# Altium schematic sheet imxbbdimm.SchDoc: IMXBB
size A3; DocumentNumber: 1; Revision: 2.0; SheetNumber: 1; SheetTotal: 9
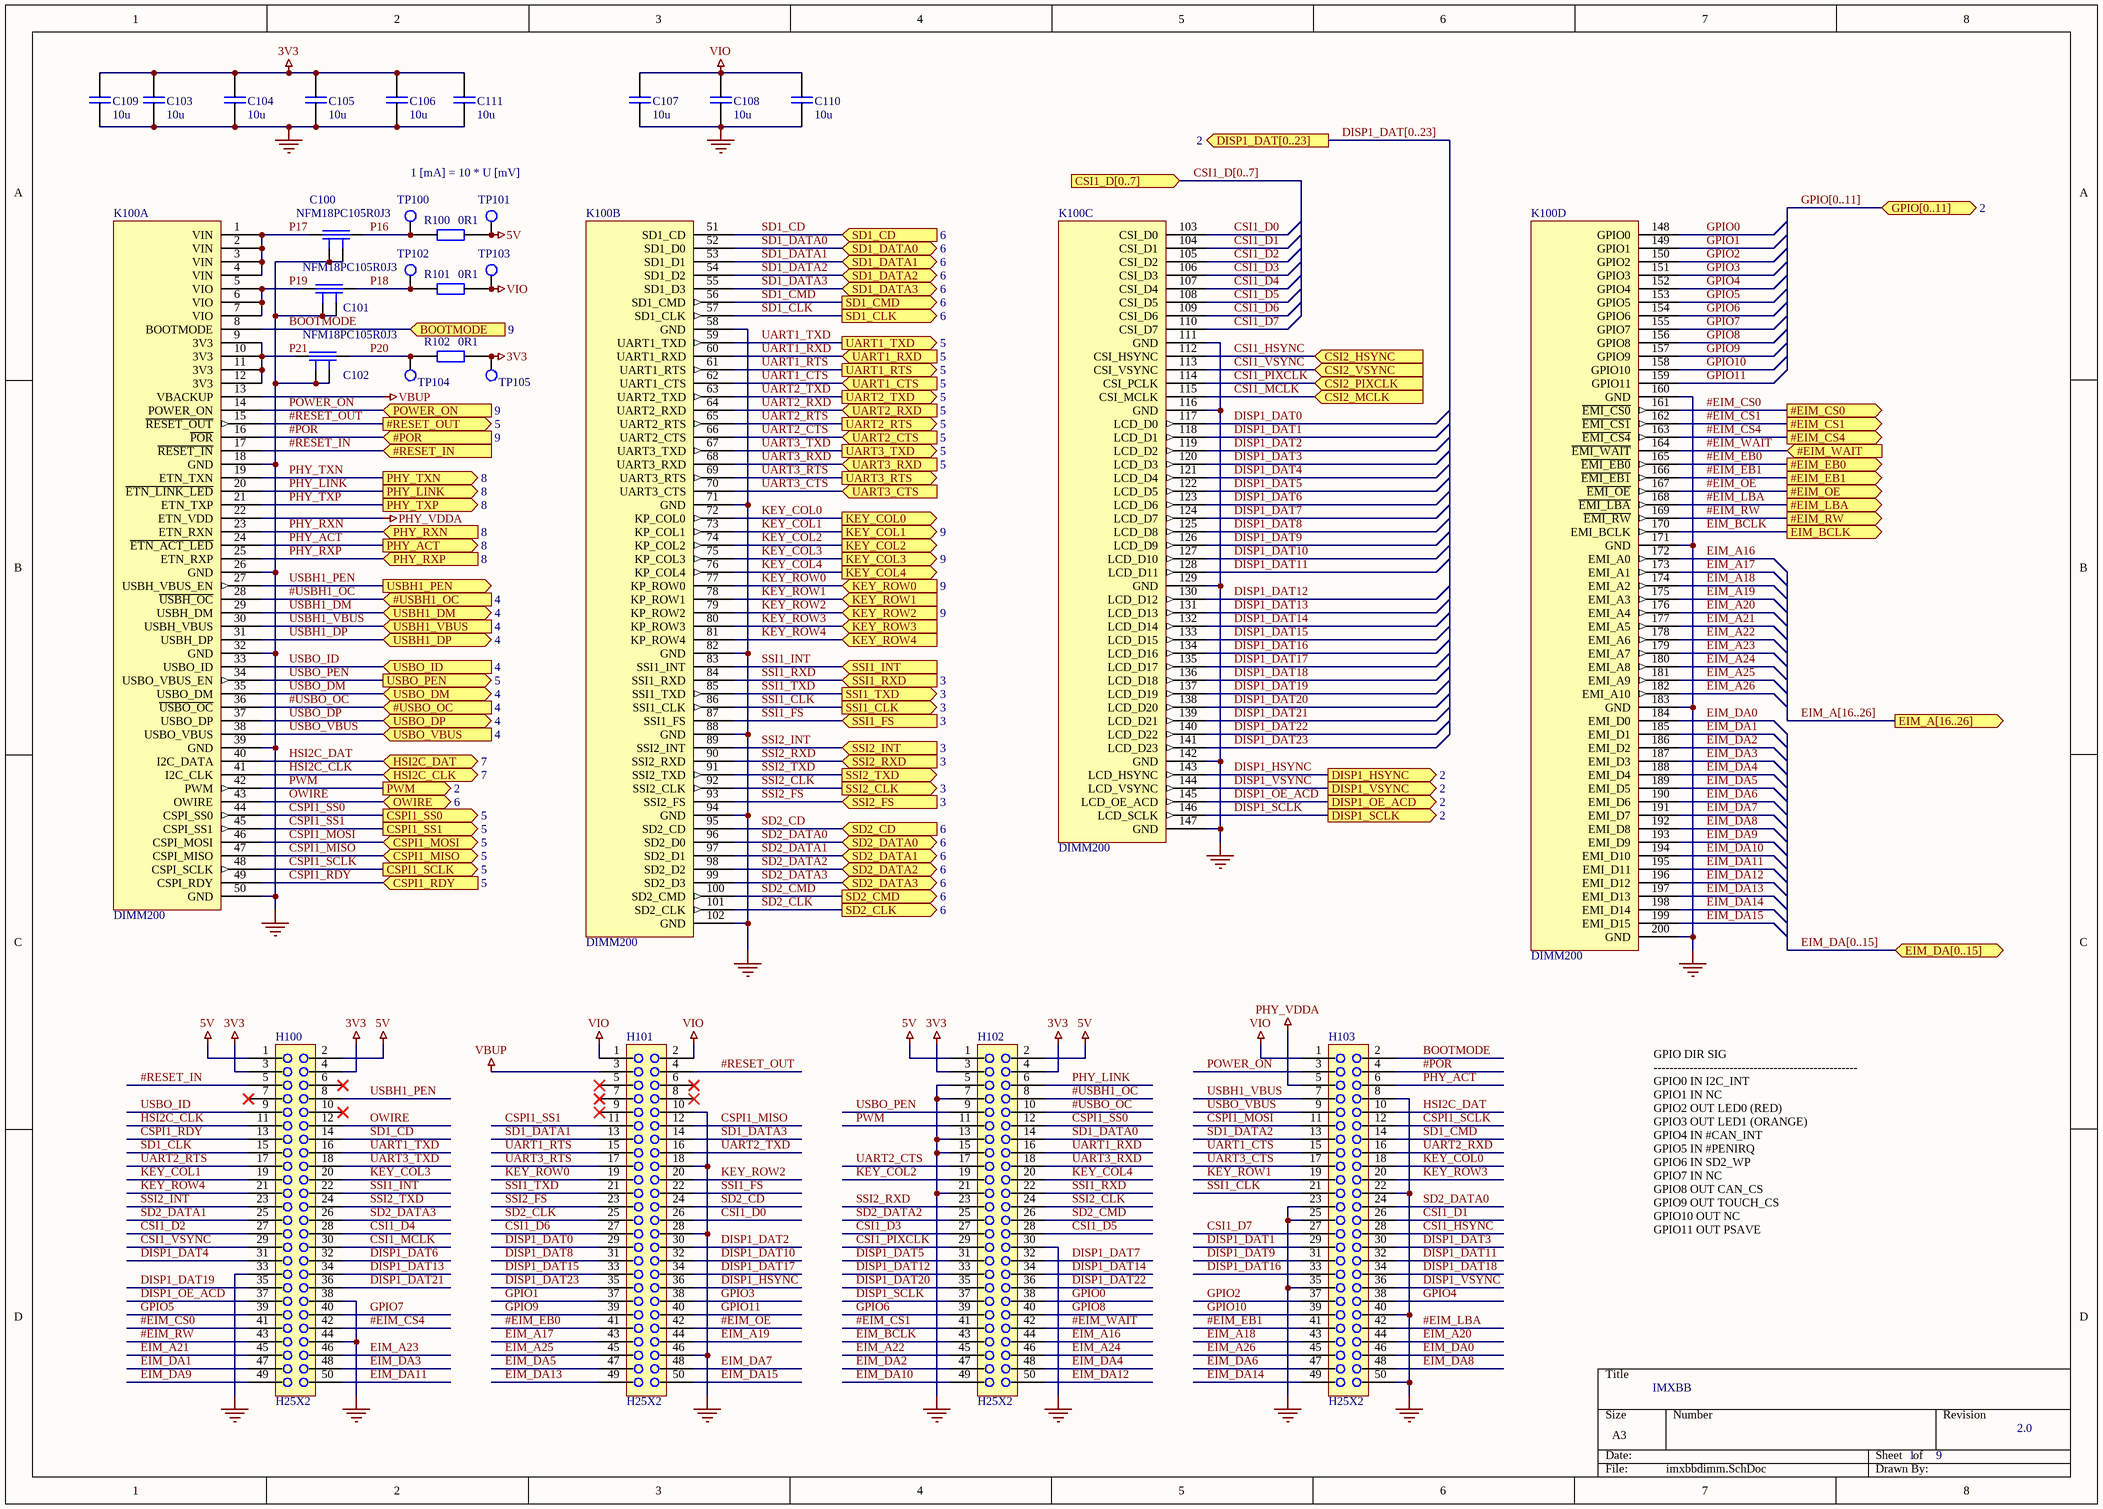
[diagram p0: imxbbdimm.SchDoc]

## Parts
C100  NFM18PC105R0J3  [NFM18P]
C101  NFM18PC105R0J3  [NFM18P]
C102  NFM18PC105R0J3  [NFM18P]
C103  10u  [0805]
C104  10u  [0805]
C105  10u  [0805]
C106  10u  [0805]
C107  10u  [0805]
C108  10u  [0805]
C109  10u  [0805]
C110  10u  [0805]
C111  10u  [0805]
H100  H25X2  [H2x25]
H101  H25X2  [H2x25]
H102  H25X2  [H2x25]
H103  H25X2  [H2x25]
K100  DIMM200  [SODIMM200EDGE]  (parts A,B,C,D of 4)
R100  0R1  [0603]
R101  0R1  [0603]
R102  0R1  [0603]
TP100  TESTPOINT  [TESTPOINT_2mm]  (value not drawn)
TP101  TESTPOINT  [TESTPOINT_2mm]  (value not drawn)
TP102  TESTPOINT  [TESTPOINT_2mm]  (value not drawn)
TP103  TESTPOINT  [TESTPOINT_2mm]  (value not drawn)
TP104  TESTPOINT  [TESTPOINT_2mm]  (value not drawn)
TP105  TESTPOINT  [TESTPOINT_2mm]  (value not drawn)

## Ports
#EIM_CS0 (out), #EIM_CS1 (out), #EIM_CS4 (out), #EIM_EB0 (out), #EIM_EB1 (out), #EIM_LBA (out), #EIM_OE (out), #EIM_RW (out), #EIM_WAIT (in), #POR (in, see 9), #RESET_IN (in), #RESET_OUT (out, see 5), #USBH1_OC (in, see 4), #USBO_OC (in, see 4), BOOTMODE (in, see 9), CSI1_D[0..7] (in), CSI2_HSYNC (in), CSI2_MCLK (in), CSI2_PIXCLK (in), CSI2_VSYNC (in), CSPI1_MISO (bidir, see 5), CSPI1_MOSI (bidir, see 5), CSPI1_RDY (in, see 5), CSPI1_SCLK (out, see 5), CSPI1_SS0 (out, see 5), CSPI1_SS1 (out, see 5), DISP1_DAT[0..23] (out, see 2), DISP1_HSYNC (out, see 2), DISP1_OE_ACD (out, see 2), DISP1_SCLK (out, see 2), DISP1_VSYNC (out, see 2), EIM_A[16..26] (out), EIM_BCLK (out), EIM_DA[0..15] (bidir), GPIO[0..11] (bidir, see 2), HSI2C_CLK (bidir, see 7), HSI2C_DAT (bidir, see 7), KEY_COL0 (out), KEY_COL1 (out, see 9), KEY_COL2 (out), KEY_COL3 (out, see 9), KEY_COL4 (out), KEY_ROW0 (in, see 9), KEY_ROW1 (in), KEY_ROW2 (in, see 9), KEY_ROW3 (in), KEY_ROW4 (in), OWIRE (bidir, see 6), PHY_ACT (out, see 8), PHY_LINK (out, see 8), PHY_RXN (in, see 8), PHY_RXP (in, see 8), PHY_TXN (out, see 8), PHY_TXP (out, see 8), POWER_ON (in, see 9), PWM (out, see 2), SD1_CD (in, see 6), SD1_CLK (out, see 6), SD1_CMD (out, see 6), SD1_DATA0 (bidir, see 6), SD1_DATA1 (bidir, see 6), SD1_DATA2 (bidir, see 6), SD1_DATA3 (bidir, see 6), SD2_CD (in, see 6), SD2_CLK (out, see 6), SD2_CMD (out, see 6), SD2_DATA0 (bidir, see 6), SD2_DATA1 (bidir, see 6), SD2_DATA2 (bidir, see 6), SD2_DATA3 (bidir, see 6), SSI1_CLK (out, see 3), SSI1_FS (in, see 3), SSI1_INT (in), SSI1_RXD (in, see 3), SSI1_TXD (out, see 3), SSI2_CLK (out, see 3), SSI2_FS (in, see 3), SSI2_INT (in, see 3), SSI2_RXD (in, see 3), SSI2_TXD (out), UART1_CTS (in, see 5), UART1_RTS (out, see 5), UART1_RXD (in, see 5), UART1_TXD (out, see 5), UART2_CTS (in, see 5), UART2_RTS (out, see 5), UART2_RXD (in, see 5), UART2_TXD (out, see 5), UART3_CTS (in), UART3_RTS (out), UART3_RXD (in, see 5), UART3_TXD (out, see 5), USBH1_DM (bidir, see 4), USBH1_DP (bidir, see 4), USBH1_PEN (out), USBH1_VBUS (in, see 4), USBO_DM (bidir, see 4), USBO_DP (bidir, see 4), USBO_ID (in, see 4), USBO_PEN (out, see 5), USBO_VBUS (in, see 4)

## Nets
3V3: C103.2 C104.2 C105.2 C106.2 C109.2 C111.2 H100.3 H100.4 H102.3 H102.4 R102.2 TP105.1
5V: H100.1 H100.2 H102.1 H102.2 R100.2 TP101.1
GND: C100.2 C100.4 C101.2 C101.4 C102.2 C102.4 C103.1 C104.1 C105.1 C106.1 C107.1 C108.1 C109.1 C110.1 C111.1 H100.33 H100.38 H100.44 H101.10 H101.18 H101.28 H101.46 H102.5 H102.7 H102.13 H102.15 H102.21 H102.30 H103.8 H103.22 H103.23 H103.25 H103.35 H103.40 H103.50 K100.18(GND) K100.26(GND) K100.32(GND) K100.39(GND) K100.50(GND) K100.58(GND) K100.71(GND) K100.82(GND) K100.88(GND) K100.94(GND) K100.102(GND) K100.111(GND) K100.116(GND) K100.129(GND) K100.142(GND) K100.147(GND) K100.160(GND) K100.171(GND) K100.183(GND) K100.200(GND)
PHY_VDDA: H103.5 K100.22(ETN_VDD)
VBUP: H101.3 K100.13(VBACKUP)
VIO: C107.2 C108.2 C110.2 H101.1 H101.2 H103.1 R101.2 TP103.1
#EIM_CS0: H100.41 K100.161(~{EMI_CS0}) ; port #EIM_CS0
#EIM_CS1: H102.41 K100.162(~{EMI_CS1}) ; port #EIM_CS1
#EIM_CS4: H100.42 K100.163(~{EMI_CS4}) ; port #EIM_CS4
#EIM_EB0: H101.41 K100.165(~{EMI_EB0}) ; port #EIM_EB0
#EIM_EB1: H103.41 K100.166(~{EMI_EB1}) ; port #EIM_EB1
#EIM_LBA: H103.42 K100.168(~{EMI_LBA}) ; port #EIM_LBA
#EIM_OE: H101.42 K100.167(~{EMI_OE}) ; port #EIM_OE
#EIM_RW: H100.43 K100.169(~{EMI_RW}) ; port #EIM_RW
#EIM_WAIT: H102.42 K100.164(~{EMI_WAIT}) ; port #EIM_WAIT
#POR: H103.4 K100.16(~{POR}) ; port #POR
#RESET_IN: H100.5 K100.17(~{RESET_IN}) ; port #RESET_IN
#RESET_OUT: H101.4 K100.15(~{RESET_OUT}) ; port #RESET_OUT
#USBH1_OC: H102.8 K100.28(~{USBH_OC}) ; port #USBH1_OC
#USBO_OC: H102.10 K100.36(~{USBO_OC}) ; port #USBO_OC
BOOTMODE: H103.2 K100.8(BOOTMODE) ; port BOOTMODE
CSI1_D0: H101.26 K100.103(CSI_D0)
CSI1_D1: H103.26 K100.104(CSI_D1)
CSI1_D2: H100.27 K100.105(CSI_D2)
CSI1_D3: H102.27 K100.106(CSI_D3)
CSI1_D4: H100.28 K100.107(CSI_D4)
CSI1_D5: H102.28 K100.108(CSI_D5)
CSI1_D6: H101.27 K100.109(CSI_D6)
CSI1_D7: H103.27 K100.110(CSI_D7)
CSI1_HSYNC: H103.28 K100.112(CSI_HSYNC) ; port CSI2_HSYNC
CSI1_MCLK: H100.30 K100.115(CSI_MCLK) ; port CSI2_MCLK
CSI1_PIXCLK: H102.29 K100.114(CSI_PCLK) ; port CSI2_PIXCLK
CSI1_VSYNC: H100.29 K100.113(CSI_VSYNC) ; port CSI2_VSYNC
CSPI1_MISO: H101.12 K100.47(CSPI_MISO) ; port CSPI1_MISO
CSPI1_MOSI: H103.11 K100.46(CSPI_MOSI) ; port CSPI1_MOSI
CSPI1_RDY: H100.13 K100.49(CSPI_RDY) ; port CSPI1_RDY
CSPI1_SCLK: H103.12 K100.48(CSPI_SCLK) ; port CSPI1_SCLK
CSPI1_SS0: H102.12 K100.44(CSPI_SS0) ; port CSPI1_SS0
CSPI1_SS1: H101.11 K100.45(CSPI_SS1) ; port CSPI1_SS1
DISP1_DAT0: H101.29 K100.117(LCD_D0)
DISP1_DAT1: H103.29 K100.118(LCD_D1)
DISP1_DAT2: H101.30 K100.119(LCD_D2)
DISP1_DAT3: H103.30 K100.120(LCD_D3)
DISP1_DAT4: H100.31 K100.121(LCD_D4)
DISP1_DAT5: H102.31 K100.122(LCD_D5)
DISP1_DAT6: H100.32 K100.123(LCD_D6)
DISP1_DAT7: H102.32 K100.124(LCD_D7)
DISP1_DAT8: H101.31 K100.125(LCD_D8)
DISP1_DAT9: H103.31 K100.126(LCD_D9)
DISP1_DAT10: H101.32 K100.127(LCD_D10)
DISP1_DAT11: H103.32 K100.128(LCD_D11)
DISP1_DAT12: H102.33 K100.130(LCD_D12)
DISP1_DAT13: H100.34 K100.131(LCD_D13)
DISP1_DAT14: H102.34 K100.132(LCD_D14)
DISP1_DAT15: H101.33 K100.133(LCD_D15)
DISP1_DAT16: H103.33 K100.134(LCD_D16)
DISP1_DAT17: H101.34 K100.135(LCD_D17)
DISP1_DAT18: H103.34 K100.136(LCD_D18)
DISP1_DAT19: H100.35 K100.137(LCD_D19)
DISP1_DAT20: H102.35 K100.138(LCD_D20)
DISP1_DAT21: H100.36 K100.139(LCD_D21)
DISP1_DAT22: H102.36 K100.140(LCD_D22)
DISP1_DAT23: H101.35 K100.141(LCD_D23)
DISP1_HSYNC: H101.36 K100.143(LCD_HSYNC) ; port DISP1_HSYNC
DISP1_OE_ACD: H100.37 K100.145(LCD_OE_ACD) ; port DISP1_OE_ACD
DISP1_SCLK: H102.37 K100.146(LCD_SCLK) ; port DISP1_SCLK
DISP1_VSYNC: H103.36 K100.144(LCD_VSYNC) ; port DISP1_VSYNC
EIM_A16: H102.44 K100.172(EMI_A0)
EIM_A17: H101.43 K100.173(EMI_A1)
EIM_A18: H103.43 K100.174(EMI_A2)
EIM_A19: H101.44 K100.175(EMI_A3)
EIM_A20: H103.44 K100.176(EMI_A4)
EIM_A21: H100.45 K100.177(EMI_A5)
EIM_A22: H102.45 K100.178(EMI_A6)
EIM_A23: H100.46 K100.179(EMI_A7)
EIM_A24: H102.46 K100.180(EMI_A8)
EIM_A25: H101.45 K100.181(EMI_A9)
EIM_A26: H103.45 K100.182(EMI_A10)
EIM_BCLK: H102.43 K100.170(EMI_BCLK) ; port EIM_BCLK
EIM_DA0: H103.46 K100.184(EMI_D0)
EIM_DA1: H100.47 K100.185(EMI_D1)
EIM_DA2: H102.47 K100.186(EMI_D2)
EIM_DA3: H100.48 K100.187(EMI_D3)
EIM_DA4: H102.48 K100.188(EMI_D4)
EIM_DA5: H101.47 K100.189(EMI_D5)
EIM_DA6: H103.47 K100.190(EMI_D6)
EIM_DA7: H101.48 K100.191(EMI_D7)
EIM_DA8: H103.48 K100.192(EMI_D8)
EIM_DA9: H100.49 K100.193(EMI_D9)
EIM_DA10: H102.49 K100.194(EMI_D10)
EIM_DA11: H100.50 K100.195(EMI_D11)
EIM_DA12: H102.50 K100.196(EMI_D12)
EIM_DA13: H101.49 K100.197(EMI_D13)
EIM_DA14: H103.49 K100.198(EMI_D14)
EIM_DA15: H101.50 K100.199(EMI_D15)
GPIO0: H102.38 K100.148(GPIO0)
GPIO1: H101.37 K100.149(GPIO1)
GPIO2: H103.37 K100.150(GPIO2)
GPIO3: H101.38 K100.151(GPIO3)
GPIO4: H103.38 K100.152(GPIO4)
GPIO5: H100.39 K100.153(GPIO5)
GPIO6: H102.39 K100.154(GPIO6)
GPIO7: H100.40 K100.155(GPIO7)
GPIO8: H102.40 K100.156(GPIO8)
GPIO9: H101.39 K100.157(GPIO9)
GPIO10: H103.39 K100.158(GPIO10)
GPIO11: H101.40 K100.159(GPIO11)
HSI2C_CLK: H100.11 K100.41(I2C_CLK) ; port HSI2C_CLK
HSI2C_DAT: H103.10 K100.40(I2C_DATA) ; port HSI2C_DAT
KEY_COL0: H103.18 K100.72(KP_COL0) ; port KEY_COL0
KEY_COL1: H100.19 K100.73(KP_COL1) ; port KEY_COL1
KEY_COL2: H102.19 K100.74(KP_COL2) ; port KEY_COL2
KEY_COL3: H100.20 K100.75(KP_COL3) ; port KEY_COL3
KEY_COL4: H102.20 K100.76(KP_COL4) ; port KEY_COL4
KEY_ROW0: H101.19 K100.77(KP_ROW0) ; port KEY_ROW0
KEY_ROW1: H103.19 K100.78(KP_ROW1) ; port KEY_ROW1
KEY_ROW2: H101.20 K100.79(KP_ROW2) ; port KEY_ROW2
KEY_ROW3: H103.20 K100.80(KP_ROW3) ; port KEY_ROW3
KEY_ROW4: H100.21 K100.81(KP_ROW4) ; port KEY_ROW4
OWIRE: H100.12 K100.43(OWIRE) ; port OWIRE
P16: C100.3 R100.1 TP100.1
P17: C100.1 K100.1(VIN) K100.2(VIN) K100.3(VIN) K100.4(VIN)
P18: C101.3 R101.1 TP102.1
P19: C101.1 K100.5(VIO) K100.6(VIO) K100.7(VIO)
P20: C102.3 R102.1 TP104.1
P21: C102.1 K100.9(3V3) K100.10(3V3) K100.11(3V3) K100.12(3V3)
PHY_ACT: H103.6 K100.24(~{ETN_ACT_LED}) ; port PHY_ACT
PHY_LINK: H102.6 K100.20(~{ETN_LINK_LED}) ; port PHY_LINK
PHY_RXN: K100.23(ETN_RXN) ; port PHY_RXN
PHY_RXP: K100.25(ETN_RXP) ; port PHY_RXP
PHY_TXN: K100.19(ETN_TXN) ; port PHY_TXN
PHY_TXP: K100.21(ETN_TXP) ; port PHY_TXP
POWER_ON: H103.3 K100.14(POWER_ON) ; port POWER_ON
PWM: H102.11 K100.42(PWM) ; port PWM
SD1_CD: H100.14 K100.51(SD1_CD) ; port SD1_CD
SD1_CLK: H100.15 K100.57(SD1_CLK) ; port SD1_CLK
SD1_CMD: H103.14 K100.56(SD1_CMD) ; port SD1_CMD
SD1_DATA0: H102.14 K100.52(SD1_D0) ; port SD1_DATA0
SD1_DATA1: H101.13 K100.53(SD1_D1) ; port SD1_DATA1
SD1_DATA2: H103.13 K100.54(SD1_D2) ; port SD1_DATA2
SD1_DATA3: H101.14 K100.55(SD1_D3) ; port SD1_DATA3
SD2_CD: H101.24 K100.95(SD2_CD) ; port SD2_CD
SD2_CLK: H101.25 K100.101(SD2_CLK) ; port SD2_CLK
SD2_CMD: H102.26 K100.100(SD2_CMD) ; port SD2_CMD
SD2_DATA0: H103.24 K100.96(SD2_D0) ; port SD2_DATA0
SD2_DATA1: H100.25 K100.97(SD2_D1) ; port SD2_DATA1
SD2_DATA2: H102.25 K100.98(SD2_D2) ; port SD2_DATA2
SD2_DATA3: H100.26 K100.99(SD2_D3) ; port SD2_DATA3
SSI1_CLK: H103.21 K100.86(SSI1_CLK) ; port SSI1_CLK
SSI1_FS: H101.22 K100.87(SSI1_FS) ; port SSI1_FS
SSI1_INT: H100.22 K100.83(SSI1_INT) ; port SSI1_INT
SSI1_RXD: H102.22 K100.84(SSI1_RXD) ; port SSI1_RXD
SSI1_TXD: H101.21 K100.85(SSI1_TXD) ; port SSI1_TXD
SSI2_CLK: H102.24 K100.92(SSI2_CLK) ; port SSI2_CLK
SSI2_FS: H101.23 K100.93(SSI2_FS) ; port SSI2_FS
SSI2_INT: H100.23 K100.89(SSI2_INT) ; port SSI2_INT
SSI2_RXD: H102.23 K100.90(SSI2_RXD) ; port SSI2_RXD
SSI2_TXD: H100.24 K100.91(SSI2_TXD) ; port SSI2_TXD
UART1_CTS: H103.15 K100.62(UART1_CTS) ; port UART1_CTS
UART1_RTS: H101.15 K100.61(UART1_RTS) ; port UART1_RTS
UART1_RXD: H102.16 K100.60(UART1_RXD) ; port UART1_RXD
UART1_TXD: H100.16 K100.59(UART1_TXD) ; port UART1_TXD
UART2_CTS: H102.17 K100.66(UART2_CTS) ; port UART2_CTS
UART2_RTS: H100.17 K100.65(UART2_RTS) ; port UART2_RTS
UART2_RXD: H103.16 K100.64(UART2_RXD) ; port UART2_RXD
UART2_TXD: H101.16 K100.63(UART2_TXD) ; port UART2_TXD
UART3_CTS: H103.17 K100.70(UART3_CTS) ; port UART3_CTS
UART3_RTS: H101.17 K100.69(UART3_RTS) ; port UART3_RTS
UART3_RXD: H102.18 K100.68(UART3_RXD) ; port UART3_RXD
UART3_TXD: H100.18 K100.67(UART3_TXD) ; port UART3_TXD
USBH1_DM: K100.29(USBH_DM) ; port USBH1_DM
USBH1_DP: K100.31(USBH_DP) ; port USBH1_DP
USBH1_PEN: H100.8 K100.27(USBH_VBUS_EN) ; port USBH1_PEN
USBH1_VBUS: H103.7 K100.30(USBH_VBUS) ; port USBH1_VBUS
USBO_DM: K100.35(USBO_DM) ; port USBO_DM
USBO_DP: K100.37(USBO_DP) ; port USBO_DP
USBO_ID: H100.9 K100.33(USBO_ID) ; port USBO_ID
USBO_PEN: H102.9 K100.34(USBO_VBUS_EN) ; port USBO_PEN
USBO_VBUS: H103.9 K100.38(USBO_VBUS) ; port USBO_VBUS

Not connected (* = marked no-connect by the designer): H100 6* 7* 10*; H101 5* 6* 7* 8* 9*

## Buses and harness runs
bus CSI1_D[0..7] = port CSI1_D[0..7]
bus DISP1_DAT[0..23] = port DISP1_DAT[0..23]
bus EIM_A[16..26] = port EIM_A[16..26]
bus EIM_DA[0..15] = port EIM_DA[0..15]
bus GPIO[0..11] = port GPIO[0..11]

## Notes on the sheet
- 1 [mA] = 10 * U [mV]
- GPIO	DIR	SIG
  ---------------------------------------------------
  GPIO0	IN	I2C_INT
  GPIO1	IN	NC
  GPIO2	OUT	LED0 (RED)
  GPIO3	OUT	LED1 (ORANGE)
  GPIO4	IN	#CAN_INT
  GPIO5	IN	#PENIRQ
  GPIO6	IN	SD2_WP
  GPIO7	IN	NC
  GPIO8	OUT	CAN_CS
  GPIO9	OUT	TOUCH_CS
  GPIO10	OUT	NC
  GPIO11	OUT	PSAVE

## Library data of the parts
C100-C102 = NFL21S: Chip EMIFIL; Producer: Murata; Order number: NFM18PC105R0J3; Component class: C; Assembly type: SMT
C103-C111 = C
R100-R102 = R
TP100-TP105 = TESTPOINT: Testpoint pad; Order number: no component; Component class: TP; Producer: n/a; Assembly type: no component